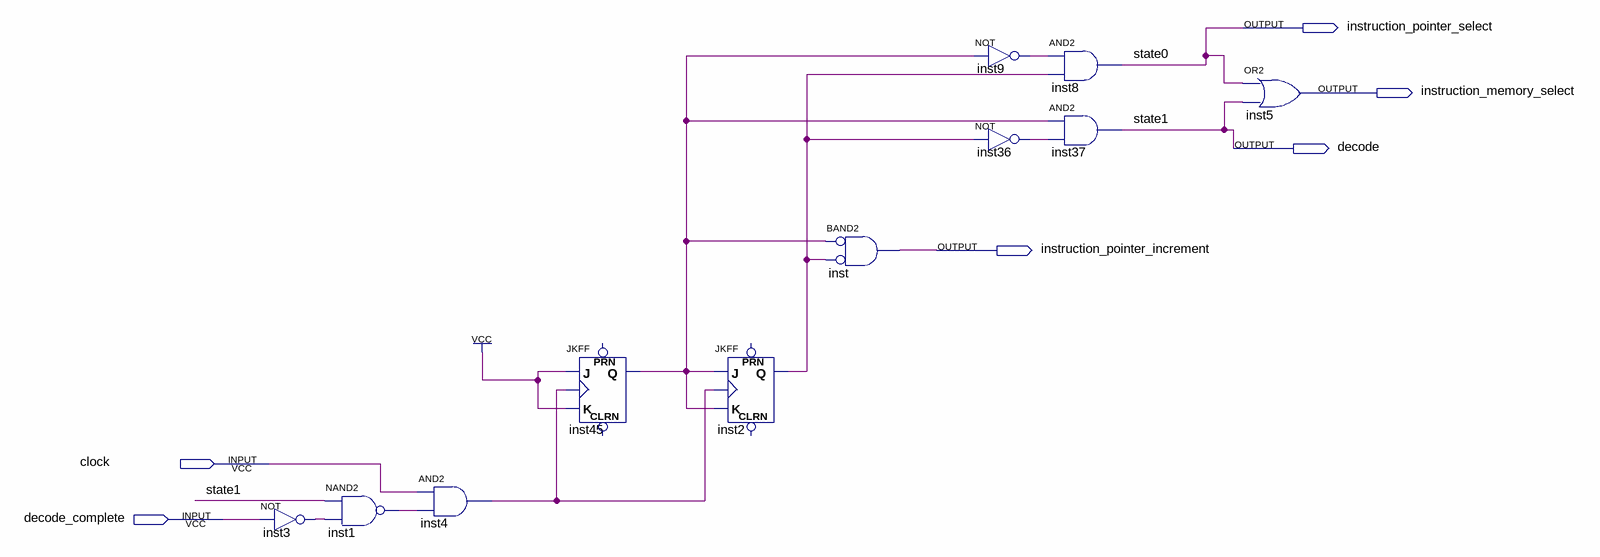
[diagram p0: schematic sheet]
// Quartus schematic instruction_load.bdf as structural Verilog: 11 symbols, 6 pins
module instruction_load (
  input  clock,
  input  decode_complete,
  output instruction_pointer_select,
  output instruction_memory_select,
  output decode,
  output instruction_pointer_increment
);

  wire inst1_out, inst2_q, inst3_out, inst4_out, inst9_out, inst36_out, inst45_q;

  not inst3 (inst3_out, decode_complete);
  nand inst1 (inst1_out, decode, inst3_out);
  and inst4 (inst4_out, clock, inst1_out);
  JKFF inst45 (.K(1'b1), .J(1'b1), .CLK(inst4_out), .Q(inst45_q));  // open: PRN, CLRN
  JKFF inst2 (.K(inst45_q), .J(inst45_q), .CLK(inst4_out), .Q(inst2_q));  // open: PRN, CLRN
  and inst (instruction_pointer_increment, ~inst45_q, ~inst2_q);  // BAND2
  not inst9 (inst9_out, inst45_q);
  not inst36 (inst36_out, inst2_q);
  and inst8 (instruction_pointer_select, inst9_out, inst2_q);
  and inst37 (decode, inst45_q, inst36_out);
  or inst5 (instruction_memory_select, instruction_pointer_select, decode);

  // Other names for the same wires on the sheet: state1 = decode; state0 = instruction_pointer_select
endmodule
